# Altium schematic sheet hub75d.SchDoc
size A3
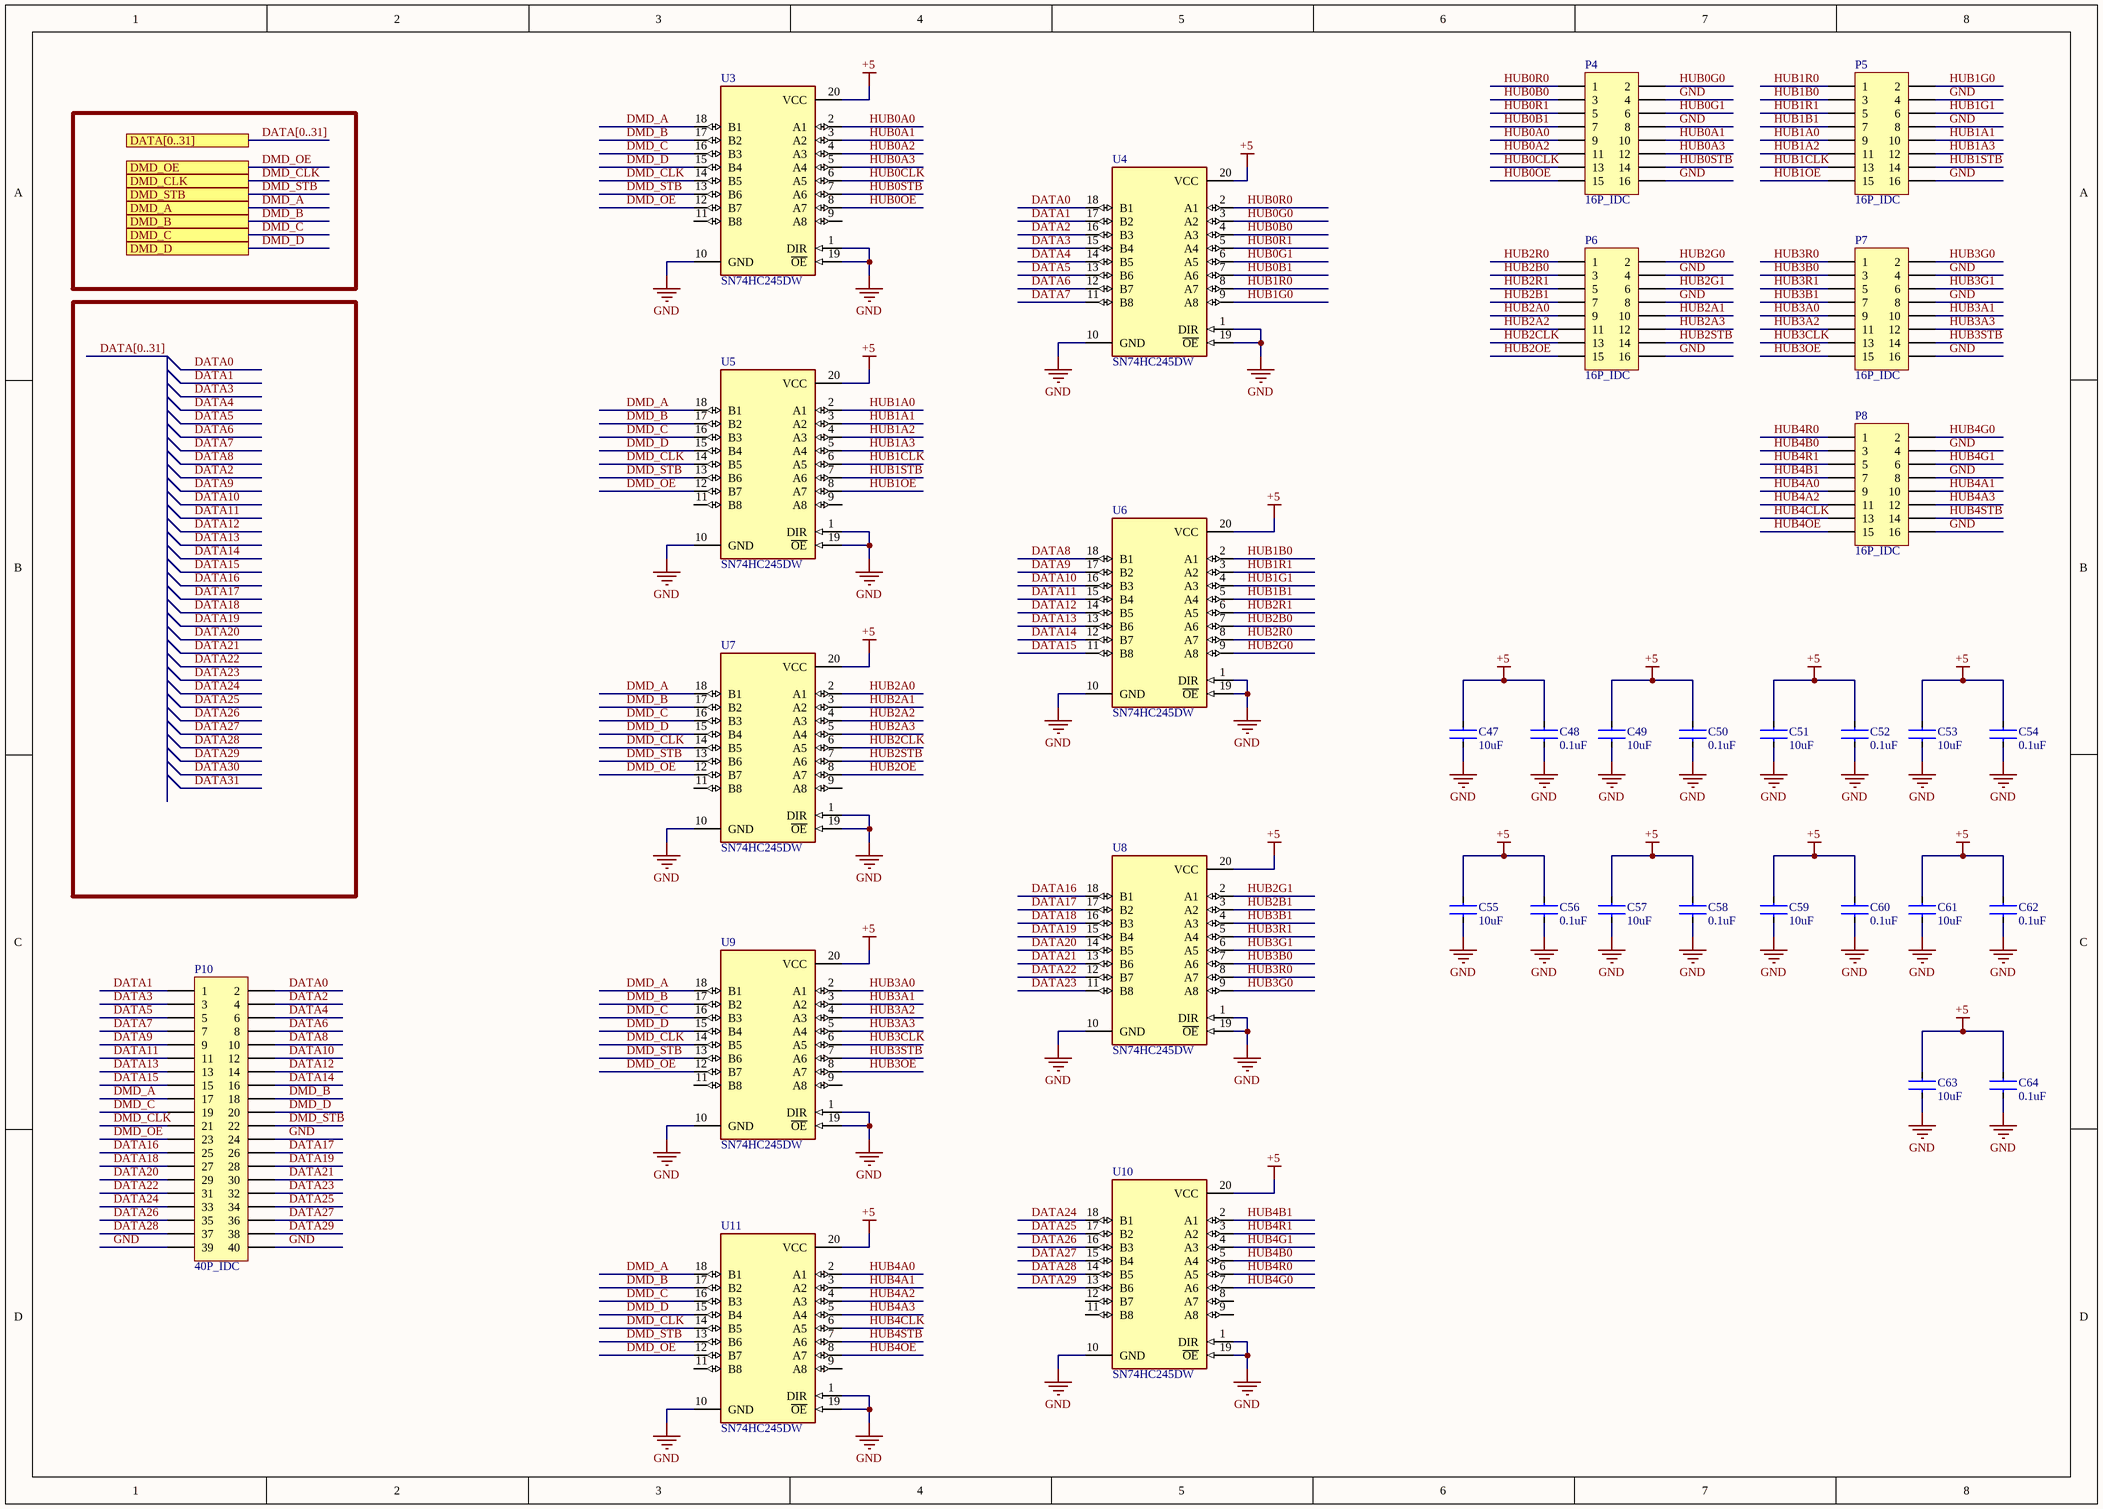
[diagram p0: hub75d.SchDoc]

## Parts
C47  10uF  [C0402]
C48  0.1uF  [C0402]
C49  10uF  [C0402]
C50  0.1uF  [C0402]
C51  10uF  [C0402]
C52  0.1uF  [C0402]
C53  10uF  [C0402]
C54  0.1uF  [C0402]
C55  10uF  [C0402]
C56  0.1uF  [C0402]
C57  10uF  [C0402]
C58  0.1uF  [C0402]
C59  10uF  [C0402]
C60  0.1uF  [C0402]
C61  10uF  [C0402]
C62  0.1uF  [C0402]
C63  10uF  [C0402]
C64  0.1uF  [C0402]
P4  16P_IDC  [16Pin_IDC_Connector]
P5  16P_IDC  [16Pin_IDC_Connector]
P6  16P_IDC  [16Pin_IDC_Connector]
P7  16P_IDC  [16Pin_IDC_Connector]
P8  16P_IDC  [16Pin_IDC_Connector]
P10  40P_IDC  [40Pin_IDC_Connector]
U3  SN74HC245DW  [DB20]
U4  SN74HC245DW  [DB20]
U5  SN74HC245DW  [DB20]
U6  SN74HC245DW  [DB20]
U7  SN74HC245DW  [DB20]
U8  SN74HC245DW  [DB20]
U9  SN74HC245DW  [DB20]
U10  SN74HC245DW  [DB20]
U11  SN74HC245DW  [DB20]

## Ports
DATA[0..31], DMD_A, DMD_B, DMD_C, DMD_CLK, DMD_D, DMD_OE, DMD_STB

## Nets
+5: C47.1 C48.1 C49.1 C50.1 C51.1 C52.1 C53.1 C54.1 C55.1 C56.1 C57.1 C58.1 C59.1 C60.1 C61.1 C62.1 C63.1 C64.1 U3.20(VCC) U4.20(VCC) U5.20(VCC) U6.20(VCC) U7.20(VCC) U8.20(VCC) U9.20(VCC) U10.20(VCC) U11.20(VCC)
GND: C47.2 C48.2 C49.2 C50.2 C51.2 C52.2 C53.2 C54.2 C55.2 C56.2 C57.2 C58.2 C59.2 C60.2 C61.2 C62.2 C63.2 C64.2 P4.4 P4.8 P4.16 P5.4 P5.8 P5.16 P6.4 P6.8 P6.16 P7.4 P7.8 P7.16 P8.4 P8.8 P8.16 P10.24 P10.39 P10.40 U3.1(DIR) U3.10(GND) U3.19(~{OE}) U4.1(DIR) U4.10(GND) U4.19(~{OE}) U5.1(DIR) U5.10(GND) U5.19(~{OE}) U6.1(DIR) U6.10(GND) U6.19(~{OE}) U7.1(DIR) U7.10(GND) U7.19(~{OE}) U8.1(DIR) U8.10(GND) U8.19(~{OE}) U9.1(DIR) U9.10(GND) U9.19(~{OE}) U10.1(DIR) U10.10(GND) U10.19(~{OE}) U11.1(DIR) U11.10(GND) U11.19(~{OE})
DATA0: P10.2 U4.18(B1)
DATA1: P10.1 U4.17(B2)
DATA2: P10.4 U4.16(B3)
DATA3: P10.3 U4.15(B4)
DATA4: P10.6 U4.14(B5)
DATA5: P10.5 U4.13(B6)
DATA6: P10.8 U4.12(B7)
DATA7: P10.7 U4.11(B8)
DATA8: P10.10 U6.18(B1)
DATA9: P10.9 U6.17(B2)
DATA10: P10.12 U6.16(B3)
DATA11: P10.11 U6.15(B4)
DATA12: P10.14 U6.14(B5)
DATA13: P10.13 U6.13(B6)
DATA14: P10.16 U6.12(B7)
DATA15: P10.15 U6.11(B8)
DATA16: P10.25 U8.18(B1)
DATA17: P10.26 U8.17(B2)
DATA18: P10.27 U8.16(B3)
DATA19: P10.28 U8.15(B4)
DATA20: P10.29 U8.14(B5)
DATA21: P10.30 U8.13(B6)
DATA22: P10.31 U8.12(B7)
DATA23: P10.32 U8.11(B8)
DATA24: P10.33 U10.18(B1)
DATA25: P10.34 U10.17(B2)
DATA26: P10.35 U10.16(B3)
DATA27: P10.36 U10.15(B4)
DATA28: P10.37 U10.14(B5)
DATA29: P10.38 U10.13(B6)
DMD_A: P10.17 U3.18(B1) U5.18(B1) U7.18(B1) U9.18(B1) U11.18(B1) ; port DMD_A
DMD_B: P10.18 U3.17(B2) U5.17(B2) U7.17(B2) U9.17(B2) U11.17(B2) ; port DMD_B
DMD_C: P10.19 U3.16(B3) U5.16(B3) U7.16(B3) U9.16(B3) U11.16(B3) ; port DMD_C
DMD_CLK: P10.21 U3.14(B5) U5.14(B5) U7.14(B5) U9.14(B5) U11.14(B5) ; port DMD_CLK
DMD_D: P10.20 U3.15(B4) U5.15(B4) U7.15(B4) U9.15(B4) U11.15(B4) ; port DMD_D
DMD_OE: P10.23 U3.12(B7) U5.12(B7) U7.12(B7) U9.12(B7) U11.12(B7) ; port DMD_OE
DMD_STB: P10.22 U3.13(B6) U5.13(B6) U7.13(B6) U9.13(B6) U11.13(B6) ; port DMD_STB
HUB0A0: P4.9 U3.2(A1)
HUB0A1: P4.10 U3.3(A2)
HUB0A2: P4.11 U3.4(A3)
HUB0A3: P4.12 U3.5(A4)
HUB0B0: P4.3 U4.4(A3)
HUB0B1: P4.7 U4.7(A6)
HUB0CLK: P4.13 U3.6(A5)
HUB0G0: P4.2 U4.3(A2)
HUB0G1: P4.6 U4.6(A5)
HUB0OE: P4.15 U3.8(A7)
HUB0R0: P4.1 U4.2(A1)
HUB0R1: P4.5 U4.5(A4)
HUB0STB: P4.14 U3.7(A6)
HUB1A0: P5.9 U5.2(A1)
HUB1A1: P5.10 U5.3(A2)
HUB1A2: P5.11 U5.4(A3)
HUB1A3: P5.12 U5.5(A4)
HUB1B0: P5.3 U6.2(A1)
HUB1B1: P5.7 U6.5(A4)
HUB1CLK: P5.13 U5.6(A5)
HUB1G0: P5.2 U4.9(A8)
HUB1G1: P5.6 U6.4(A3)
HUB1OE: P5.15 U5.8(A7)
HUB1R0: P5.1 U4.8(A7)
HUB1R1: P5.5 U6.3(A2)
HUB1STB: P5.14 U5.7(A6)
HUB2A0: P6.9 U7.2(A1)
HUB2A1: P6.10 U7.3(A2)
HUB2A2: P6.11 U7.4(A3)
HUB2A3: P6.12 U7.5(A4)
HUB2B0: P6.3 U6.7(A6)
HUB2B1: P6.7 U8.3(A2)
HUB2CLK: P6.13 U7.6(A5)
HUB2G0: P6.2 U6.9(A8)
HUB2G1: P6.6 U8.2(A1)
HUB2OE: P6.15 U7.8(A7)
HUB2R0: P6.1 U6.8(A7)
HUB2R1: P6.5 U6.6(A5)
HUB2STB: P6.14 U7.7(A6)
HUB3A0: P7.9 U9.2(A1)
HUB3A1: P7.10 U9.3(A2)
HUB3A2: P7.11 U9.4(A3)
HUB3A3: P7.12 U9.5(A4)
HUB3B0: P7.3 U8.7(A6)
HUB3B1: P7.7 U8.4(A3)
HUB3CLK: P7.13 U9.6(A5)
HUB3G0: P7.2 U8.9(A8)
HUB3G1: P7.6 U8.6(A5)
HUB3OE: P7.15 U9.8(A7)
HUB3R0: P7.1 U8.8(A7)
HUB3R1: P7.5 U8.5(A4)
HUB3STB: P7.14 U9.7(A6)
HUB4A0: P8.9 U11.2(A1)
HUB4A1: P8.10 U11.3(A2)
HUB4A2: P8.11 U11.4(A3)
HUB4A3: P8.12 U11.5(A4)
HUB4B0: P8.3 U10.5(A4)
HUB4B1: P8.7 U10.2(A1)
HUB4CLK: P8.13 U11.6(A5)
HUB4G0: P8.2 U10.7(A6)
HUB4G1: P8.6 U10.4(A3)
HUB4OE: P8.15 U11.8(A7)
HUB4R0: P8.1 U10.6(A5)
HUB4R1: P8.5 U10.3(A2)
HUB4STB: P8.14 U11.7(A6)

Not connected (* = marked no-connect by the designer): U3 9(A8) 11(B8); U5 9(A8) 11(B8); U7 9(A8) 11(B8); U9 9(A8) 11(B8); U10 8(A7) 9(A8) 11(B8) 12(B7); U11 9(A8) 11(B8)

## Buses and harness runs
bus DATA[0..31]
bus DATA[0..31] = port DATA[0..31]

## Library data of the parts
C47 C49 C51 C53 C55 C57 C59 C61 C63 = CL31B106KOHNNNE: Cap Ceramic 10uF 16V X7R 10% Pad SMD 1206 125°C T/R; Manufacturer: Samsung; Supplier 1: Future Electronics; Manufacturer Part Number: CL31B106KOHNNNE; RoHS: Yes; Category: Ceramic Capacitors; Stock 1: 116000; Pricing 1: 2000=0.03800, 6000=0.03460, 8000=0.03450, 20000=0.03420, 30000=0.03400 (USD); Mount: Surface Mount; Case/Package: 1206; Case Code (Metric): 3216; Case Code (Imperial): 1206; Material: Ceramic; Contact Plating: Tin; Min Operating Temperature: -55°C; Max Operating Temperature: 125°C; Capacitance: 10uF; Tolerance: 10%; Dielectric: X7R; Package Quantity: 1; Packaging: Tape and Reel; Voltage Rating: 16V; Series: CL; Length: 3.2mm; Width: 0.063inch; Height: 1.6mm; Thickness: 0.071inch; Depth: 1.6mm; RoHS Compliant: Yes; ComponentLink1URL: https://datasheet.ciiva.com/25795/cl31b106kohnnne-25795201.pdf?src-supplier=Digi-Key; ComponentLink1Description: https://datasheet.ciiva.com/25795/cl31b106kohnnne-25795201.pdf?src-supplier=Digi-Key; ComponentLink2URL: https://datasheet.ciiva.com/29201/452535-da-01-en-vs-kondensator-1206-29201132.pdf?src-supplier=Conrad; ComponentLink2Description: https://datasheet.ciiva.com/29201/452535-da-01-en-vs-kondensator-1206-29201132.pdf?src-supplier=Conrad; Supplier Part Number 1: 2558872
C48 C50 C52 C54 C56 C58 C60 C62 C64 = CL31B104KBCNNNC: Ceramic capacitor SMD-1206 100nF /50V X7R# K +-10%, Samsung, RoHS; Tolerance: 10%; Dielectric: X7R; Voltage: 50V; Supplier 1: Arrow Electronics; Manufacturer: Samsung; Manufacturer Part Number: CL31B104KBCNNNC; RoHS: Yes; Category: Ceramic Capacitors; Stock 1: 3508000; Pricing 1: 4000=0.02060, 8000=0.01660 (USD); Mount: Surface Mount; Case/Package: 1206; Case Code (Metric): 3216; Case Code (Imperial): 1206; Material: Ceramic; Contact Plating: Tin; Min Operating Temperature: -55°C; Max Operating Temperature: 125°C; Capacitance: 100nF; Voltage Rating (DC): 50V; Packaging: Tape and Reel; Voltage Rating: 50V; Series: CL; Length: 3.2mm; Width: 0.063inch; Height: 0.85mm; Depth: 1.6mm; Thickness: 0.037inch; Radiation Hardening: No; Lead Free: Lead Free; RoHS Compliant: Yes; ComponentLink1URL: https://datasheet.ciiva.com/25710/cl31b104kbcnnnc-25710293.pdf?src-supplier=Digi-Key; ComponentLink1Description: https://datasheet.ciiva.com/25710/cl31b104kbcnnnc-25710293.pdf?src-supplier=Digi-Key; ComponentLink2URL: https://datasheet.ciiva.com/29201/451941-da-01-en-vs-kondensator-1206-29201689.pdf?src-supplier=Conrad; ComponentLink2Description: https://datasheet.ciiva.com/29201/451941-da-01-en-vs-kondensator-1206-29201689.pdf?src-supplier=Conrad; ComponentLink3URL: https://datasheet.ciiva.com/16298/cl05b104kq5nnnc-16298186.pdf?src-supplier=Future+Electronics; ComponentLink3Description: https://datasheet.ciiva.com/16298/cl05b104kq5nnnc-16298186.pdf?src-supplier=Future+Electronics; Supplier Part Number 1: CL31B104KBCNNNC
P4-P8 = BHR-16-VUA: Headers & Wire Housings 16P STRAIGHT; Manufacturer: Adam Equipment; Current Rating: 1A; Number of Positions: 16; Pitch: 2.54mm; Supplier 1: Digi-Key; Manufacturer Part Number: BHR-16-VUA; RoHS: Yes; Category: Connectors; Stock 1: 804; Pricing 1: 1=0.45000, 10=0.42400, 100=0.29690, 500=0.25452, 1000=0.21210, 5000=0.18180, 10000=0.16968 (USD); Contact Plating: Gold; Contact Material: Brass; Package Quantity: 276; Number of Rows: 2; Packaging: Tray; Orientation: Straight; Termination: IDC; Lead Free: Lead Free; ComponentLink1URL: https://datasheet.ciiva.com/16418/page-319-321-16418937.pdf?src-supplier=Future+Electronics; ComponentLink1Description: https://datasheet.ciiva.com/16418/page-319-321-16418937.pdf?src-supplier=Future+Electronics; Supplier Part Number 1: 2057-BHR-16-VUA-ND
P10 = BHR-40-VUA: Conn Shrouded Header (4 Sides) HDR 40 POS 2.54mm Solder ST Top Entry Thru-Hole Tray; Manufacturer: Adam Equipment; Manufacturer Part Number: BHR-20-VUA; Current Rating: 1A; Number of Positions: 20; Supplier 1: Digi-Key; RoHS: Yes; Category: Connectors; Stock 1: 1576; Pricing 1: 1=0.44000, 10=0.41700, 160=0.31944, 480=0.27775, 800=0.24998, 5120=0.20137, 10080=0.18748 (USD); Contact Material: Brass; Contact Plating: Gold; Number of Rows: 2; Packaging: Tray; Package Quantity: 216; Termination: IDC; Pitch: 2.54mm; Lead Free: Lead Free; ComponentLink1URL: https://datasheet.ciiva.com/16418/page-319-321-16418950.pdf?src-supplier=Future+Electronics; ComponentLink1Description: https://datasheet.ciiva.com/16418/page-319-321-16418950.pdf?src-supplier=Future+Electronics; Supplier Part Number 1: 2057-BHR-20-VUA-ND
U3-U11 = SN74HC245DW: Transceiver, Non-Inverting 1 Element 8 Bit per Element Push-Pull Output 20-SOIC; Manufacturer: Texas Instruments; Min Supply Voltage: 2V; Max Supply Voltage: 6V; Number of Channels: 8; Operating Supply Voltage: 5V; Number of Elements: 1; Direction: Bidirectional; Propagation Delay: 22ns; High Level Output Current: -7.8mA; Low Level Output Current: 7.8mA; Logic Function: Transceiver,Inverting; Turn-On Delay Time: 335ns; Quiescent Current: 8uA; Supplier 1: Rochester Electronics; Manufacturer Part Number: SN74HC245DW; RoHS: Yes; Category: Buffers, Drivers and Transceivers; Stock 1: 10523; Pricing 1: 1=0.59230, 25=0.58040, 100=0.56860, 500=0.55680, 1000=0.54490 (USD); Mount: Surface Mount; Case/Package: SOIC; Number of Pins: 20; Weight: 0.017662oz; Contact Plating: Gold; Min Operating Temperature: -40°C; Max Operating Temperature: 85°C; Packaging: Rail/Tube; Package Quantity: 25; Number of Bits per Element: 8; Number of Circuits: 8; Polarity: Non-Inverting; Number of Outputs: 8; Number of Bits: 8; Output Current: 7.8mA; Max Output Current: 7.8mA; Length: 12.8mm; Width: 7.52mm; Height: 2.35mm; Radiation Hardening: No; Lead Free: Lead Free; RoHS Compliant: Yes; REACH SVHC: No SVHC; ComponentLink1URL: https://datasheet.ciiva.com/7747/1635564-7747846.pdf?src-supplier=Element14; ComponentLink1Description: https://datasheet.ciiva.com/7747/1635564-7747846.pdf?src-supplier=Element14; ComponentLink2URL: https://datasheet.ciiva.com/15086/getdatasheetpartid-250110-15086515.pdf?src-supplier=Verical; ComponentLink2Description: https://datasheet.ciiva.com/15086/getdatasheetpartid-250110-15086515.pdf?src-supplier=Verical; ComponentLink3URL: https://datasheet.ciiva.com/1837/sn74hc245-1837904.pdf?src-supplier=Digi-Key; ComponentLink3Description: https://datasheet.ciiva.com/1837/sn74hc245-1837904.pdf?src-supplier=Digi-Key; ComponentLink4URL: https://datasheet.ciiva.com/14300/sn54hc245-sp-14300744.pdf?src-supplier=Avnet; ComponentLink4Description: https://datasheet.ciiva.com/14300/sn54hc245-sp-14300744.pdf?src-supplier=Avnet; Supplier Part Number 1: SN74HC245DW